# EAGLE design 7W Audio Amplifier (EAGLE 6.4)
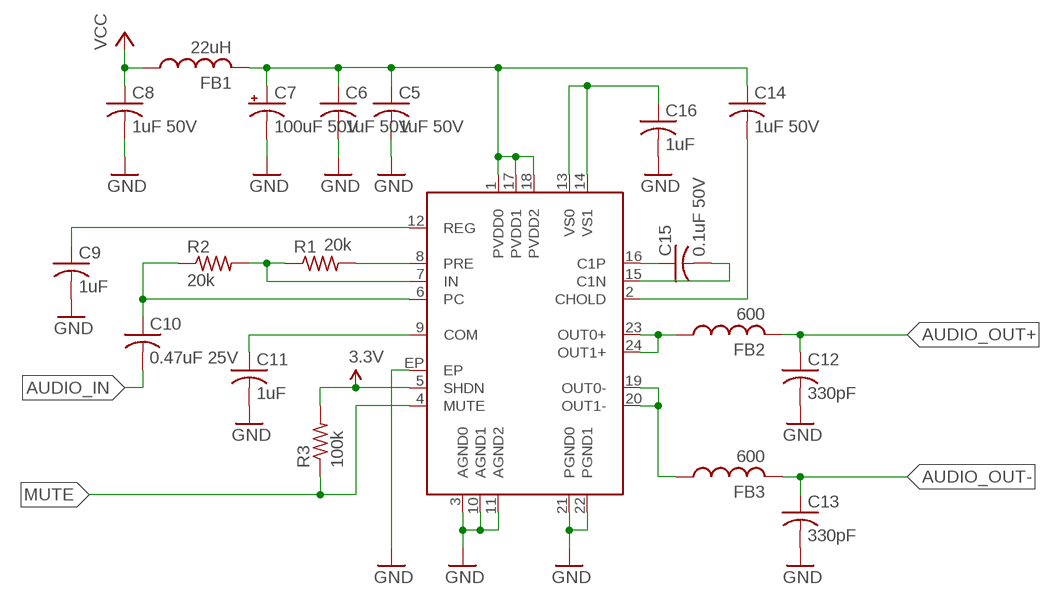
[diagram p0: schematic, sheet 1]

## Parts
C5  1uF 50V  CAP0805  [0805_CAP]
C6  1uF 50V  CAP0805  [0805_CAP]
C7  100uF 50V  CAP_POLF  [F_CAP]
C8  1uF 50V  CAP0805  [0805_CAP]
C9  1uF  CAP0603  [0603_CAP]
C10  0.47uF 25V  CAP0603  [0603_CAP]
C11  1uF  CAP0603  [0603_CAP]
C12  330pF  CAP0603  [0603_CAP]
C13  330pF  CAP0603  [0603_CAP]
C14  1uF 50V  CAP0805  [0805_CAP]
C15  0.1uF 50V  CAP0603  [0603_CAP]
C16  1uF  CAP0603  [0603_CAP]
FB1  22uH  FB0805  [0805_FB]
FB2  600  FB0805  [0805_FB]
FB3  600  FB0805  [0805_FB]
MAX1  MAX9737  [TQFN24]
R1  20k  RESISTOR0603  [0603_RESISTOR]
R2  20k  RESISTOR0603  [0603_RESISTOR]
R3  100k  RESISTOR0603  [0603_RESISTOR]

## Nets
3.3V: MAX1.5(SHDN) R3.2
AUDIO_IN: C10.2
AUDIO_OUT+: C12.1 FB2.2
AUDIO_OUT-: C13.1 FB3.2
GND: C5.2 C6.2 C7.- C8.2 C9.2 C11.2 C12.2 C13.2 C16.2 MAX1.3(AGND0) MAX1.10(AGND1) MAX1.11(AGND2) MAX1.21(PGND0) MAX1.22(PGND1) MAX1.EP
MUTE: MAX1.4(MUTE) R3.1
N$2: C9.1 MAX1.12(REG)
N$3: MAX1.8(PRE) R1.2
N$4: C5.1 C6.1 C7.+ C14.1 FB1.2 MAX1.1(PVDD0) MAX1.17(PVDD1) MAX1.18(PVDD2)
N$5: MAX1.7(IN) R1.1 R2.2
N$6: C10.1 MAX1.6(PC) R2.1
N$7: C11.1 MAX1.9(COM)
N$9: C14.2 MAX1.2(CHOLD)
N$10: C15.1 MAX1.16(C1P)
N$11: C15.2 MAX1.15(C1N)
N$13: C16.1 MAX1.13(VS0) MAX1.14(VS1)
N$14: FB3.1 MAX1.19(OUT0-) MAX1.20(OUT1-)
N$16: FB2.1 MAX1.23(OUT0+) MAX1.24(OUT1+)
VCC: C8.1 FB1.1

## Library data of the parts
C5 C6 C8 C14 = jkf:CAP; DIGIKEY#: 445-7547-1-ND
C7 = jkf:CAP_POL; DIGIKEY#: PCE3917CT-ND
C9 C11 C16 = jkf:CAP; DIGIKEY#: 445-5138-1-ND
C10 = jkf:CAP; DIGIKEY#: 445-7418-1-ND
C12 C13 = jkf:CAP; DIGIKEY#: 445-5074-1-ND
C15 = jkf:CAP; DIGIKEY#: 445-1314-1-ND
FB1 = jkf:FB; DIGIKEY#: 490-5987-1-ND
FB2 FB3 = jkf:FB; DIGIKEY#: 445-2206-1-ND
MAX1 = jkf:MAX9737; DIGIKEY#: MAX9737ETG+TCT-ND; MANF: Maxim; MANF#: MAX9737ETG+T
R1 R2 = jkf:RESISTOR; DIGIKEY#: RHM20.0KCFCT-ND
R3 = jkf:RESISTOR; DIGIKEY#: 311-100KGRCT-ND

## Board
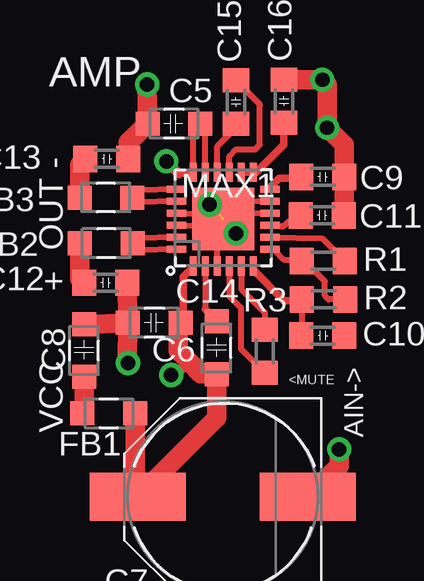
[diagram p1: board, top side]
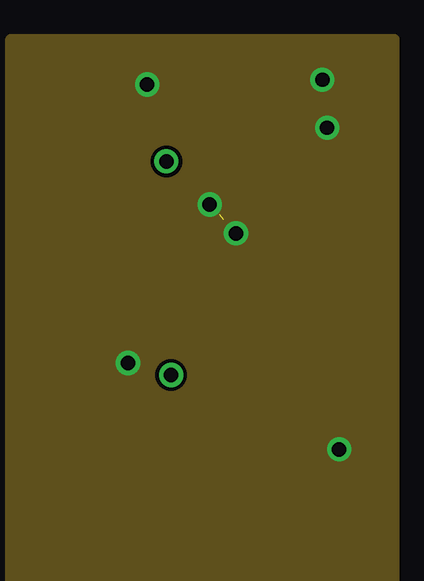
[diagram p2: board, inner layer GND]
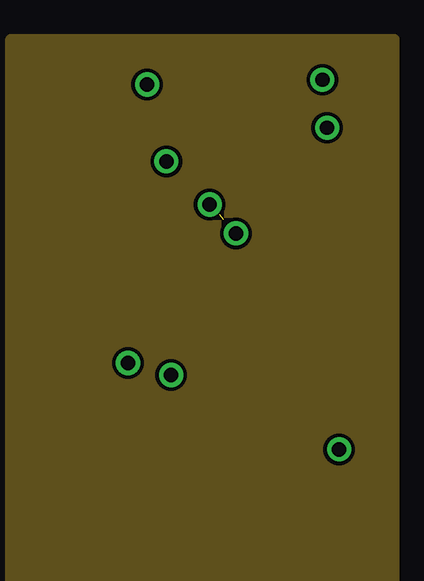
[diagram p3: board, inner layer 3.3V]
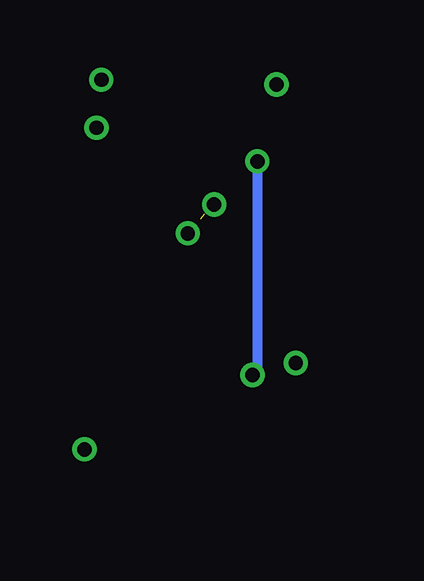
[diagram p4: board, bottom side, seen from below]

No outline drawn. Coordinates in mm, seen from the top.
Copper layers (1+2*15+16): Top 0.0178mm / dielectric 12mil / GND 0.0356mm / dielectric 28mil / 3.3V 0.0356mm / dielectric 12mil / Bottom 0.0178mm
Design rules "SSC-EAGLE-4Lyr_v1.0.0.3": minimum track width 6mil, minimum drill 8mil, track to track 6mil, track to pad 6mil, pad to pad 6mil, via to via 6mil, smd to smd 6mil, copper to edge 20mil, drill to drill 16mil, minimum pad ring 8mil, minimum via ring 8mil, stop-mask expansion 3mil, vias tented up to drill 0mil, thermal gap 10mil

### Footprints (pad centres in the part's own frame; a part is rotated, then mirrored left to right if it is on the bottom)
0805_CAP = smd 1 x 1: 1 -1.13,0; 2 1.07,0
F_CAP = smd 4 x 2: + 3.55,0; - -3.55,0
0603_CAP = smd 1 x 1.1: 1 -0.9,0; 2 0.9,0
0805_FB = smd 1 x 1: 1 -1.1,0; 2 1.1,0
TQFN24 = smd 0.8 x 0.3: 1 -1.95,1.25; 2 -1.95,0.75; 3 -1.95,0.25; 4 -1.95,-0.25; 5 -1.95,-0.75; 6 -1.95,-1.25; 13 1.95,-1.25; 14 1.95,-0.75; 15 1.95,-0.25; 16 1.95,0.25; 17 1.95,0.75; 18 1.95,1.25 | smd 0.3 x 0.8: 7 -1.25,-1.95; 8 -0.75,-1.95; 9 -0.25,-1.95; 10 0.25,-1.95; 11 0.75,-1.95; 12 1.25,-1.95; 19 1.25,1.95; 20 0.75,1.95; 21 0.25,1.95; 22 -0.25,1.95; 23 -0.75,1.95; 24 -1.25,1.95 | smd 2.6 x 2.6: EP 0,0
0603_RESISTOR = smd 1 x 1.1: 1 -0.9,0; 2 0.9,0

### Placement (x,y rotation side)
C5  7.06,21.74 180 top
C6  6.24,13.44 180 top
C7  9.12,6.19 180 top
C8  3.34,12.32 90 top
C9  13.28,19.52 0 top
C10  13.29,12.91 0 top
C11  13.26,17.92 0 top
C12  4.24,15.11 0 top
C13  4.29,20.27 0 top
C14  8.86,12.43 90 top
C15  9.67,22.64 90 top
C16  11.67,22.68 90 top
FB1  4.37,9.67 0 top
FB2  4.27,16.76 180 top
FB3  4.25,18.66 180 top
MAX1  9.14,17.76 90 top
R1  13.3,16.02 0 top
R2  13.32,14.42 0 top
R3  10.87,12.26 90 top

### Tracks (layer width: path | path; a pad name or v marks a point on that pad's centre or on a via)
3.3V
  Top 0.254: MAX1.5 9.89,14.85 10.87,13.87 R3.2
  pour 3.3V: 0.27,25.27 16.27,25.27 16.27,0.27 0.27,0.27
AUDIO_OUT+
  Top 0.813: FB2.2 3.17,15.28 C12.1
AUDIO_OUT-
  Top 0.813: FB3.2 3.15,20.03 C13.1
GND  (via drill 0.6)  (1 unrouted)
  Top 0.254: MAX1.3 8.89,18.05 v8.57,18.37 | MAX1.10 8.98,17.96 | MAX1.11 9.27,18.46 8.66,18.46 | MAX1.22 8.57,17.46 v8.57,18.37 | MAX1.21 8.57,17.96 v8.57,18.37
  Top 0.305: 8.66,18.46 v8.57,18.37 | 8.98,17.96 8.98,18.17 9.27,18.46
  Top 0.813: C12.2 C6.2 | C6.2 5.14,11.8 v5.17,11.77 | C16.2 v13.26,23.58 v13.27,23.57 13.47,23.37 v13.47,21.57 14.18,20.86 C9.2 14.18,17.94 C11.2 | C13.2 5.19,20.97 C5.2 v5.96,23.36 v5.97,23.37 | v13.97,8.17 13.97,7.49 C7.- | C8.2 5.12,13.42 C6.2
  other vias: 9.67,17.17
  pour GND: 0.27,25.27 16.27,25.27 16.27,0.27 0.27,0.27
MUTE
  Top 0.254: MAX1.4 9.39,14.55 9.87,14.07 9.87,12.36 R3.1
N$2
  Top 0.305: MAX1.12 11.09,19.09 11.47,19.47 12.33,19.47 C9.1
N$3
  Top 0.254: MAX1.8 13.26,16.96 R1.2
N$4  (via drill 0.6)
  Top 0.254: MAX1.17 8.39,21.51 | MAX1.18 7.89,21.47
  Top 0.305: 8.39,21.51 C5.1 7.89,21.47 | MAX1.1 7.86,15.76 7.47,15.37 7.47,13.57 C6.1 | MAX1.18 7.28,19.66
  Top 0.406: 7.28,19.66 v6.77,20.17 | v6.97,11.27 7.17,11.27 7.72,11.82
  Top 0.813: C6.1 7.27,13.37 7.27,12.27 7.72,11.82 8.21,11.33 C14.1 8.86,9.48 5.96,6.58 | 5.96,6.58 C7.+ | FB1.2 5.47,7.07 5.96,6.58
  Bottom 0.305: 6.77,11.47 v6.97,11.27
  Bottom 0.406: v6.77,20.17 6.77,11.47
N$5
  Top 0.254: MAX1.7 11.28,16.46 11.67,16.07 12.35,16.07 R1.1 12.75,15.67 12.87,15.67 13.37,15.17 13.37,14.57 13.52,14.42 R2.2
N$6
  Top 0.254: R2.1 12.42,12.94
  Top 0.305: 12.42,12.94 C10.1 | MAX1.6 10.39,15.65 11.67,14.37 12.37,14.37 R2.1
N$7
  Top 0.254: MAX1.9 11.56,17.46 11.57,17.47 11.67,17.47 11.87,17.67 12.11,17.67 C11.1
N$9
  Top 0.254: MAX1.2 8.39,14
  Top 0.305: 8.39,14 C14.2
N$10
  Top 0.254: MAX1.16 8.89,20.79 9.37,21.27 9.37,21.44 C15.1
N$11
  Top 0.254: C15.2 10.67,22.54 10.67,20.87 10.47,20.67 9.67,20.67 9.39,20.39 MAX1.15
N$13
  Top 0.305: MAX1.14 MAX1.13 10.46,19.66 11.67,20.87 C16.1
N$14
  Top 0.254: MAX1.19 5.65,18.96 | MAX1.20 5.55,18.46
  Top 0.305: 5.65,18.96 FB3.1 5.55,18.46
N$16
  Top 0.254: MAX1.23 5.57,16.96 | MAX1.24 5.67,16.46
  Top 0.305: 5.57,16.96 FB2.1 5.67,16.46
VCC
  Top 0.813: C8.1 3.34,9.74 FB1.1

### Text on the board
tSilk: AMP | - | OUT | + | <MUTE | VCC | AIN->